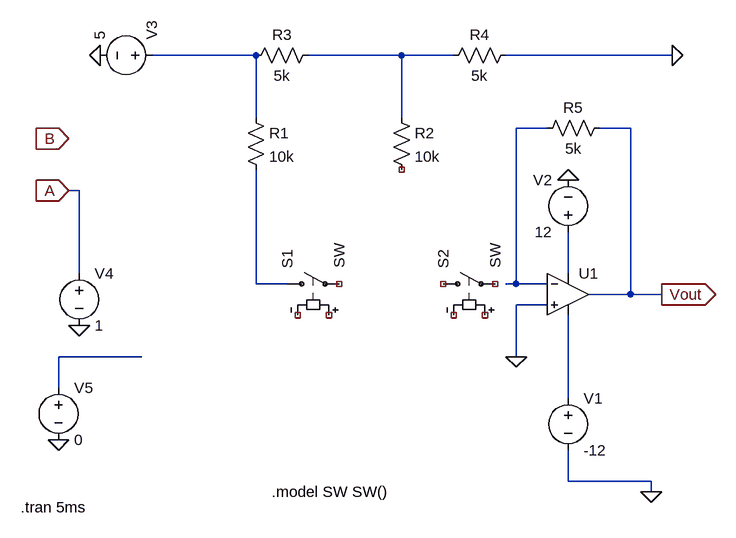
[diagram p0: schematic DacR2r.asc]
DacR2r.asc, the LTspice schematic file:
Version 4
SHEET 1 1380 680
WIRE 80 -176 -80 -176
WIRE 304 -176 160 -176
WIRE 384 -176 304 -176
WIRE 720 -176 464 -176
WIRE 80 -80 80 -176
WIRE 304 -80 304 -176
WIRE 528 -64 480 -64
WIRE 656 -64 608 -64
WIRE -192 32 -208 32
WIRE -192 160 -192 32
WIRE 560 160 560 96
WIRE 80 176 80 0
WIRE 128 176 80 176
WIRE 480 176 480 -64
WIRE 480 176 464 176
WIRE 528 176 480 176
WIRE 656 192 656 -64
WIRE 656 192 592 192
WIRE 704 192 656 192
WIRE 528 208 480 208
WIRE -96 288 -224 288
WIRE 480 288 480 208
WIRE -224 336 -224 288
WIRE 560 352 560 224
WIRE 560 480 560 432
WIRE 688 480 560 480
WIRE 688 496 688 480
FLAG -208 32 A
IOPIN -208 32 In
FLAG -208 -48 B
IOPIN -208 -48 In
FLAG 704 192 Vout
IOPIN 704 192 Out
FLAG 688 496 0
FLAG 560 16 0
FLAG -160 -176 0
FLAG 480 288 0
FLAG -192 240 0
FLAG -224 416 0
FLAG 720 -176 0
SYMBOL res 64 -96 R0
SYMATTR InstName R1
SYMATTR Value 10k
SYMBOL res 288 -96 R0
SYMATTR InstName R2
SYMATTR Value 10k
SYMBOL res 176 -192 R90
WINDOW 0 0 56 VBottom 2
WINDOW 3 32 56 VTop 2
SYMATTR InstName R3
SYMATTR Value 5k
SYMBOL res 480 -192 R90
WINDOW 0 0 56 VBottom 2
WINDOW 3 32 56 VTop 2
SYMATTR InstName R4
SYMATTR Value 5k
SYMBOL voltage 560 336 R0
WINDOW 123 0 0 Left 0
WINDOW 39 0 0 Left 0
SYMATTR InstName V1
SYMATTR Value -12
SYMBOL voltage 560 112 R180
WINDOW 0 24 96 Left 2
WINDOW 3 24 16 Left 2
WINDOW 123 0 0 Left 0
WINDOW 39 0 0 Left 0
SYMATTR InstName V2
SYMATTR Value 12
SYMBOL Opamps\\UniversalOpamp2 560 192 R0
SYMATTR InstName U1
SYMBOL voltage -64 -176 M270
WINDOW 123 0 0 Left 0
WINDOW 39 0 0 Left 0
SYMATTR InstName V3
SYMATTR Value 5
SYMBOL res 624 -80 R90
WINDOW 0 0 56 VBottom 2
WINDOW 3 32 56 VTop 2
SYMATTR InstName R5
SYMATTR Value 5k
SYMBOL voltage -192 144 R0
WINDOW 123 0 0 Left 0
WINDOW 39 0 0 Left 0
SYMATTR InstName V4
SYMATTR Value 1
SYMBOL voltage -224 320 R0
WINDOW 123 0 0 Left 0
WINDOW 39 0 0 Left 0
SYMATTR InstName V5
SYMATTR Value 0
SYMBOL sw 112 176 R270
SYMATTR InstName S1
SYMBOL sw 352 176 R270
SYMATTR InstName S2
TEXT -282 520 Left 2 !.tran 5ms
TEXT 104 496 Left 2 !.model SW SW()

The netlist it stands for:
* DacR2r.asc
R1 N001 N005 10k
R2 N002 NC_01 10k
R3 N002 N001 5k
R4 0 N002 5k
V1 N007 0 -12
V2 N004 0 12
XU1 0 N003 N004 N007 Vout level.2 Avol=1Meg GBW=10Meg Slew=10Meg ilimit=25m rail=0 Vos=0 phimargin=45 en=0 enk=0 in=0 ink=0 Rin=500Meg  ; pins IN+ IN- V+ V- OUT
V3 N001 0 5
R5 Vout N003 5k
V4 A 0 1
V5 N006 0 0
S1 N005 NC_02 NC_03 NC_04 SW
S2 NC_05 NC_06 NC_07 NC_08 SW
.tran 5ms
.model SW SW()
.lib UniversalOpamps2.sub
.backanno
.end